# Altium schematic sheet jlink_main.SchDoc
size A4
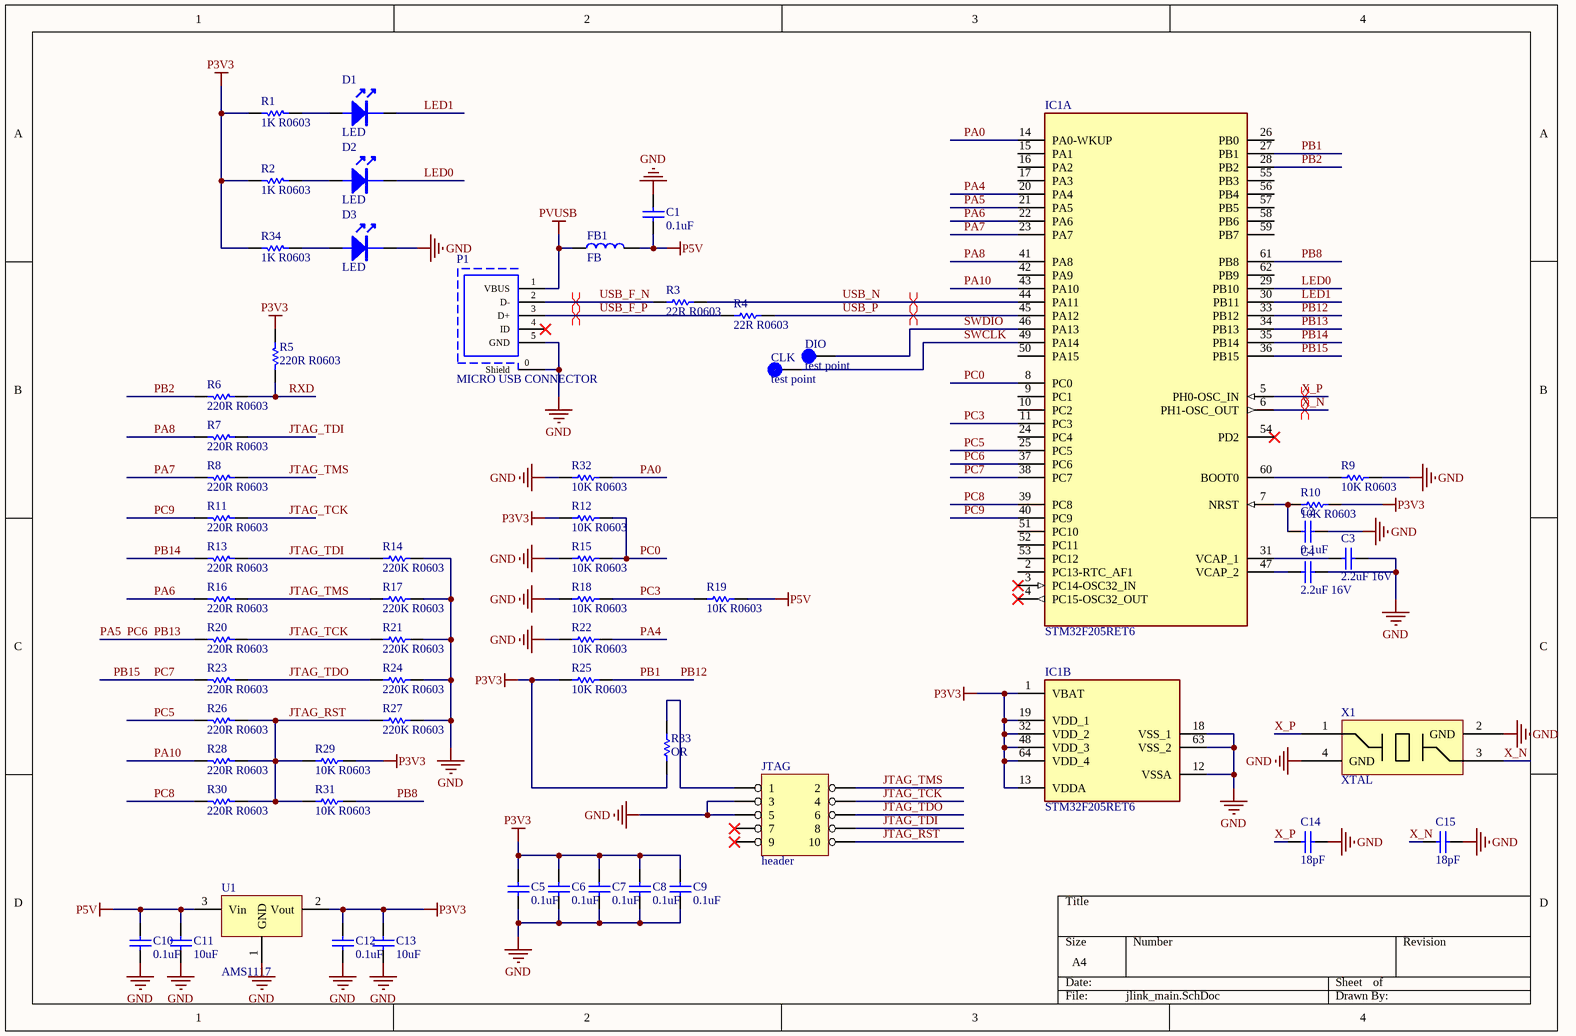
[diagram p0: jlink_main.SchDoc]

## Parts
C1  0.1uF  [0603_C]
C2  0.1uF  [0603_C]
C3  2.2uF 16V  [0603_C]
C4  2.2uF 16V  [0603_C]
C5  0.1uF  [0603_C]
C6  0.1uF  [0603_C]
C7  0.1uF  [0603_C]
C8  0.1uF  [0603_C]
C9  0.1uF  [0603_C]
C10  0.1uF  [0603_C]
C11  10uF  [0805_c]
C12  0.1uF  [0603_C]
C13  10uF  [0805_c]
C14  18pF  [0603_C]
C15  18pF  [0603_C]
CLK  test point  [TESTPOINT]
D1  LED  [0603_LED]
D2  LED  [0603_LED]
D3  LED  [0603_LED]
DIO  test point  [TESTPOINT]
FB1  FB  [FB0603]
IC1  STM32F205RET6  [QFP50P1200X1200X160-64N]  (parts A,B of 2)
JTAG  header  [header2X5]
P1  MICRO USB CONNECTOR  [USB_Micro_qian]
R1  1K R0603  [0603_R]
R2  1K R0603  [0603_R]
R3  22R R0603  [0603_R]
R4  22R R0603  [0603_R]
R5  220R R0603  [0603_R]
R6  220R R0603  [0603_R]
R7  220R R0603  [0603_R]
R8  220R R0603  [0603_R]
R9  10K R0603  [0603_R]
R10  10K R0603  [0603_R]
R11  220R R0603  [0603_R]
R12  10K R0603  [0603_R]
R13  220R R0603  [0603_R]
R14  220K R0603  [0603_R]
R15  10K R0603  [0603_R]
R16  220R R0603  [0603_R]
R17  220K R0603  [0603_R]
R18  10K R0603  [0603_R]
R19  10K R0603  [0603_R]
R20  220R R0603  [0603_R]
R21  220K R0603  [0603_R]
R22  10K R0603  [0603_R]
R23  220R R0603  [0603_R]
R24  220K R0603  [0603_R]
R25  10K R0603  [0603_R]
R26  220R R0603  [0603_R]
R27  220K R0603  [0603_R]
R28  220R R0603  [0603_R]
R29  10K R0603  [0603_R]
R30  220R R0603  [0603_R]
R31  10K R0603  [0603_R]
R32  10K R0603  [0603_R]
R33  OR  [0603_R]
R34  1K R0603  [0603_R]
U1  AMS1117  [SOT-223]
X1  XTAL  [OSC_KH3225_4P]

## Nets
GND: C1.2 C2.1 C3.2 C4.2 C5.1 C6.1 C7.1 C8.1 C9.1 C10.1 C11.1 C12.1 C13.1 C14.1 C15.2 D3.2(K) IC1.12(VSSA) IC1.18(VSS_1) IC1.63(VSS_2) JTAG.3 JTAG.5 P1.0(Shield) P1.5(GND) R9.2 R14.2 R15.1 R17.2 R18.1 R21.2 R22.1 R24.2 R27.2 R32.1 U1.1(GND) X1.2(GND) X1.4(GND)
P3V3: C5.2 C6.2 C7.2 C8.2 C9.2 C12.2 C13.2 IC1.1(VBAT) IC1.13(VDDA) IC1.19(VDD_1) IC1.32(VDD_2) IC1.48(VDD_3) IC1.64(VDD_4) R1.2 R2.2 R5.1 R10.2 R12.1 R25.1 R29.2 R33.1 R34.2 U1.2(Vout)
P5V: C1.1 C10.2 C11.2 FB1.2 R19.2 U1.3(Vin)
PVUSB: FB1.1 P1.1(VBUS)
JTAG_RST: JTAG.10 R26.1 R27.1 R28.1 R29.1 R30.1 R31.1
JTAG_TCK: JTAG.4 R11.1 R20.1 R21.1
JTAG_TDI: JTAG.8 R7.1 R13.1 R14.1
JTAG_TDO: JTAG.6 R23.1 R24.1
JTAG_TMS: JTAG.2 R8.1 R16.1 R17.1
LED0: D2.2(K) IC1.29(PB10)
LED1: D1.2(K) IC1.30(PB11)
PA0: IC1.14(PA0-WKUP) R32.2
PA4: IC1.20(PA4) R22.2
PA5: IC1.21(PA5) IC1.34(PB13) IC1.37(PC6) R20.2  [also labelled PB13, PC6]
PA6: IC1.22(PA6) R16.2
PA7: IC1.23(PA7) R8.2
PA8: IC1.41(PA8) R7.2
PA10: IC1.43(PA10) R28.2
PB1: IC1.27(PB1) IC1.33(PB12) R25.2  [also labelled PB12]
PB2: IC1.28(PB2) R6.2
PB8: IC1.61(PB8) R31.2
PB14: IC1.35(PB14) R13.2
PB15: IC1.36(PB15) IC1.38(PC7) R23.2  [also labelled PC7]
PC0: IC1.8(PC0) R12.2 R15.2
PC3: IC1.11(PC3) R18.2 R19.1
PC5: IC1.25(PC5) R26.2
PC8: IC1.39(PC8) R30.2
PC9: IC1.40(PC9) R11.2
RXD: R5.2 R6.1
SWCLK: CLK.1(TP) IC1.49(PA14)
SWDIO: DIO.1(TP) IC1.46(PA13)
USB_F_N: P1.2(D-) R3.1
USB_F_P: P1.3(D+) R4.1
USB_N: IC1.44(PA11) R3.2
USB_P: IC1.45(PA12) R4.2
X_N: C15.1 IC1.6(PH1-OSC_OUT) X1.3(OSC2)
X_P: C14.2 IC1.5(PH0-OSC_IN) X1.1(OSC1)
NetC2_2: C2.2 IC1.7(NRST) R10.1
NetC3_1: C3.1 IC1.31(VCAP_1)
NetC4_1: C4.1 IC1.47(VCAP_2)
NetD1_1: D1.1(A) R1.1
NetD2_1: D2.1(A) R2.1
NetD3_1: D3.1(A) R34.1
NetIC1_60: IC1.60(BOOT0) R9.1
NetJTAG_1: JTAG.1 R33.2

Not connected (* = marked no-connect by the designer): IC1 2(PC13-RTC_AF1) 3(PC14-OSC32_IN)* 4(PC15-OSC32_OUT)* 9(PC1) 10(PC2) 15(PA1) 16(PA2) 17(PA3) 24(PC4) 26(PB0) 42(PA9) 50(PA15) 51(PC10) 52(PC11) 53(PC12) 54(PD2)* 55(PB3) 56(PB4) 57(PB5) 58(PB6) 59(PB7) 62(PB9); JTAG 7* 9*; P1 4(ID)*

## Layout directives
differential pair: USB_F_N, USB_F_P, USB_N, USB_P, X_N, X_P

## Library data of the parts
C1-C15 = CAP: Capacitor; Value: 104; Published: 8-Jun-2000; LatestRevisionDate: 17-Jul-2002; LatestRevisionNote: Re-released for DXP Platform.; PackageReference: RAD-0.3; Publisher: Altium Limited
CLK DIO = TESTPOINT
D1-D3 = LED: LED 发光二极管
FB1 = FB: 磁珠
IC1 = STM32F205RET6: Integrated Circuit; Manufacturer_Name: STMicroelectronics; Datasheet Link: http://www.st.com/web/en/resource/technical/document/datasheet/CD00237391.pdf; Height: 1.6mm; Manufacturer_Part_Number: STM32F205RET6; Arrow Part Number: STM32F205RET6; Arrow Price/Stock: https://www.arrow.com/en/products/stm32f205ret6/stmicroelectronics; Mouser Part Number: 511-STM32F205RET6; Mouser Price/Stock: https://www.mouser.co.uk/ProductDetail/STMicroelectronics/STM32F205RET6?qs=L6eUzyzWLAvGHDSxS%252B7umA%3D%3D
JTAG = HEADER 5X2
P1 = MICRO USB_in
R1 R2 R34 = RES: Resistor; Published: 8-Jun-2000; Revision: July-2002: Re-released for DXP Platform.; Publisher: Altium Limited; Value: 1K
R3-R33 = RES: Resistor; Value: 1K; Published: 8-Jun-2000; Revision: July-2002: Re-released for DXP Platform.; Publisher: Altium Limited
U1 = AMS1117: 3.3V电压转换器AMS1117
X1 = XTAL_SMT